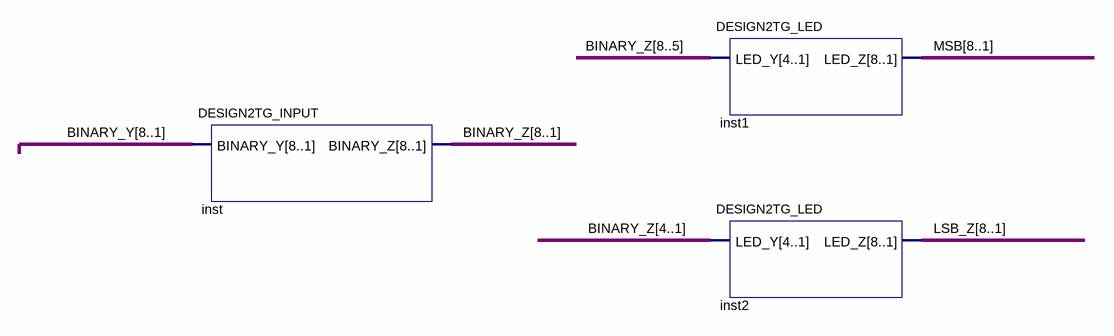
[diagram p0: schematic sheet]
// Quartus schematic DESIGN2TG_block.bdf as structural Verilog: 3 symbols, 0 pins
module DESIGN2TG_block (
);

  wire [8:1] BINARY_Y, BINARY_Z, LSB_Z, MSB;

  DESIGN2TG_INPUT inst (.BINARY_Y(BINARY_Y), .BINARY_Z(BINARY_Z));
  DESIGN2TG_LED inst1 (.LED_Y(BINARY_Z[8:5]), .LED_Z(MSB));
  DESIGN2TG_LED inst2 (.LED_Y(BINARY_Z[4:1]), .LED_Z(LSB_Z));
endmodule
